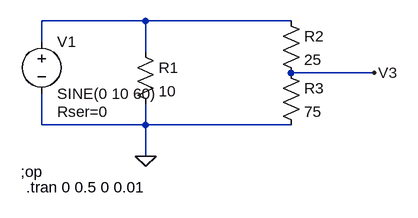
[diagram p0: schematic dynamic_network_part1.asc]
dynamic_network_part1.asc, the LTspice schematic file:
Version 4
SHEET 1 880 680
WIRE 64 32 -96 32
WIRE 288 32 64 32
WIRE -96 64 -96 32
WIRE 64 80 64 32
WIRE 416 112 288 112
WIRE -96 192 -96 144
WIRE 64 192 64 160
WIRE 64 192 -96 192
WIRE 288 192 64 192
WIRE 64 240 64 192
FLAG 64 240 0
FLAG 416 112 V3
SYMBOL res 48 64 R0
SYMATTR InstName R1
SYMATTR Value 10
SYMATTR SpiceLine tol=1 pwr=0.1
SYMBOL res 272 16 R0
SYMATTR InstName R2
SYMATTR Value 25
SYMATTR SpiceLine tol=1 pwr=0.1
SYMBOL res 272 96 R0
SYMATTR InstName R3
SYMATTR Value 75
SYMATTR SpiceLine tol=1 pwr=0.1
SYMBOL voltage -96 48 R0
WINDOW 123 0 0 Left 2
WINDOW 39 24 124 Left 2
SYMATTR SpiceLine Rser=0
SYMATTR InstName V1
SYMATTR Value SINE(0 10 60)
TEXT -128 264 Left 2 !;op
TEXT -120 288 Left 2 !.tran 0 0.5 0 0.01

The netlist it stands for:
* dynamic_network_part1.asc
R1 N001 0 10 tol=1 pwr=0.1
R2 N001 V3 25 tol=1 pwr=0.1
R3 V3 0 75 tol=1 pwr=0.1
V1 N001 0 SINE(0 10 60) Rser=0
;op
.tran 0 0.5 0 0.01
.backanno
.end